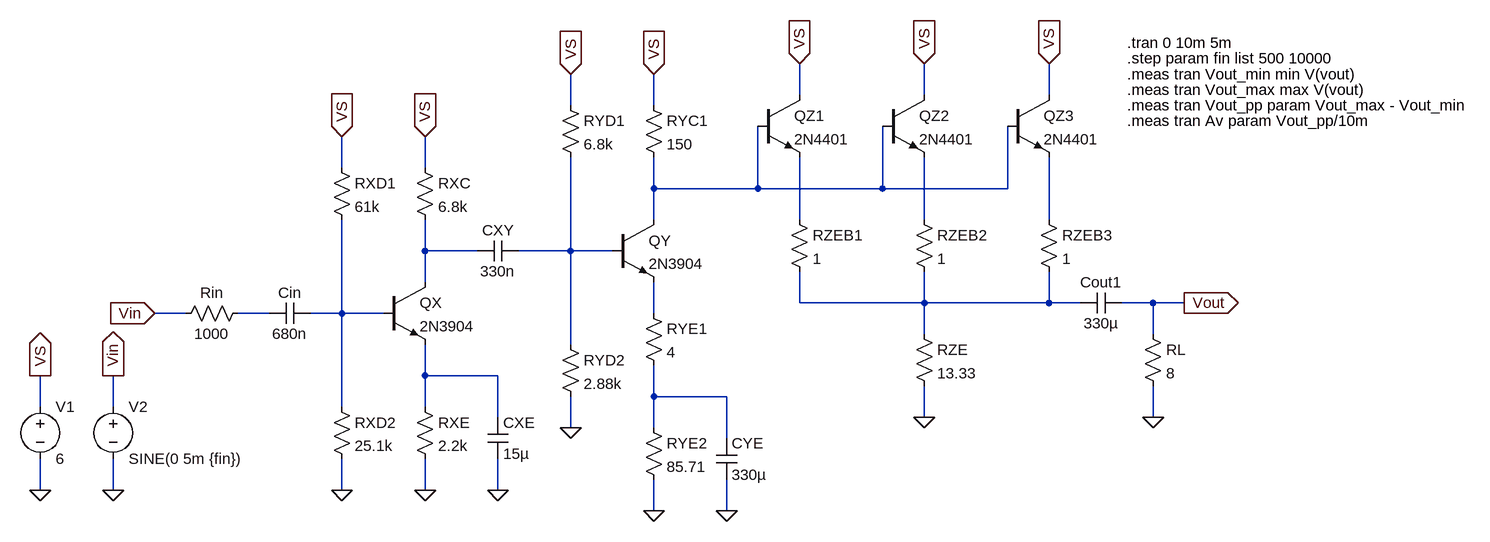
[diagram p0: schematic full.asc]
full.asc, the LTspice schematic file:
Version 4.1
SHEET 1 1884 740
WIRE 800 -224 800 -272
WIRE 992 -224 992 -272
WIRE 1184 -224 1184 -272
WIRE 448 -208 448 -256
WIRE 576 -208 576 -256
WIRE 96 -112 96 -160
WIRE 224 -112 224 -160
WIRE 576 -80 576 -128
WIRE 736 -80 736 -176
WIRE 736 -80 576 -80
WIRE 928 -80 928 -176
WIRE 928 -80 736 -80
WIRE 1120 -80 1120 -176
WIRE 1120 -80 928 -80
WIRE 576 -32 576 -80
WIRE 800 -32 800 -128
WIRE 992 -32 992 -128
WIRE 1184 -32 1184 -128
WIRE 224 16 224 -32
WIRE 304 16 224 16
WIRE 448 16 448 -128
WIRE 448 16 368 16
WIRE 512 16 448 16
WIRE 224 64 224 16
WIRE 800 96 800 48
WIRE 992 96 992 48
WIRE 992 96 800 96
WIRE 1184 96 1184 48
WIRE 1184 96 992 96
WIRE 1232 96 1184 96
WIRE 1344 96 1296 96
WIRE 1392 96 1344 96
WIRE -144 112 -192 112
WIRE -16 112 -64 112
WIRE 96 112 96 -32
WIRE 96 112 48 112
WIRE 160 112 96 112
WIRE 576 112 576 64
WIRE 992 144 992 96
WIRE 1344 144 1344 96
WIRE 448 160 448 16
WIRE 224 208 224 160
WIRE 336 208 224 208
WIRE 576 240 576 192
WIRE 688 240 576 240
WIRE -368 256 -368 208
WIRE -256 256 -256 208
WIRE 96 256 96 112
WIRE 224 256 224 208
WIRE 336 272 336 208
WIRE 992 272 992 224
WIRE 1344 272 1344 224
WIRE 448 288 448 240
WIRE 576 288 576 240
WIRE 688 304 688 240
WIRE -368 384 -368 336
WIRE -256 384 -256 336
WIRE 96 384 96 336
WIRE 224 384 224 336
WIRE 336 384 336 336
WIRE 576 416 576 368
WIRE 688 416 688 368
FLAG 224 384 0
FLAG 336 384 0
FLAG 96 384 0
FLAG -192 112 Vin
IOPIN -192 112 In
FLAG 96 -160 VS
IOPIN 96 -160 In
FLAG 224 -160 VS
IOPIN 224 -160 In
FLAG -256 384 0
FLAG -368 384 0
FLAG -368 208 VS
IOPIN -368 208 Out
FLAG -256 208 Vin
IOPIN -256 208 Out
FLAG 576 416 0
FLAG 688 416 0
FLAG 448 288 0
FLAG 448 -256 VS
IOPIN 448 -256 In
FLAG 576 -256 VS
IOPIN 576 -256 In
FLAG 800 -272 VS
IOPIN 800 -272 In
FLAG 992 -272 VS
IOPIN 992 -272 In
FLAG 1184 -272 VS
IOPIN 1184 -272 In
FLAG 992 272 0
FLAG 1344 272 0
FLAG 1392 96 Vout
IOPIN 1392 96 Out
SYMBOL npn 160 64 R0
SYMATTR InstName QX
SYMATTR Value 2N3904
SYMBOL res 208 240 R0
SYMATTR InstName RXE
SYMATTR Value 2.2k
SYMBOL cap 320 272 R0
SYMATTR InstName CXE
SYMATTR Value 15µ
SYMBOL res 208 -128 R0
SYMATTR InstName RXC
SYMATTR Value 6.8k
SYMBOL res 80 -128 R0
SYMATTR InstName RXD1
SYMATTR Value 61k
SYMBOL res 80 240 R0
SYMATTR InstName RXD2
SYMATTR Value 25.1k
SYMBOL voltage -256 240 R0
WINDOW 123 0 0 Left 0
WINDOW 39 0 0 Left 0
SYMATTR InstName V2
SYMATTR Value SINE(0 5m {fin})
SYMBOL voltage -368 240 R0
SYMATTR InstName V1
SYMATTR Value 6
SYMBOL cap 48 96 R90
WINDOW 0 0 32 VBottom 2
WINDOW 3 32 32 VTop 2
SYMATTR InstName Cin
SYMATTR Value 680n
SYMBOL cap 368 0 R90
WINDOW 0 0 32 VBottom 2
WINDOW 3 32 32 VTop 2
SYMATTR InstName CXY
SYMATTR Value 330n
SYMBOL res -48 96 R90
WINDOW 0 0 56 VBottom 2
WINDOW 3 32 56 VTop 2
SYMATTR InstName Rin
SYMATTR Value 1000
SYMBOL npn 512 -32 R0
SYMATTR InstName QY
SYMATTR Value 2N3904
SYMBOL res 560 272 R0
SYMATTR InstName RYE2
SYMATTR Value 85.71
SYMBOL cap 672 304 R0
SYMATTR InstName CYE
SYMATTR Value 330µ
SYMBOL res 560 -224 R0
SYMATTR InstName RYC1
SYMATTR Value 150
SYMBOL res 432 -224 R0
SYMATTR InstName RYD1
SYMATTR Value 6.8k
SYMBOL res 432 144 R0
SYMATTR InstName RYD2
SYMATTR Value 2.88k
SYMBOL res 560 96 R0
SYMATTR InstName RYE1
SYMATTR Value 4
SYMBOL npn 736 -224 R0
SYMATTR InstName QZ1
SYMATTR Value 2N4401
SYMBOL npn 928 -224 R0
SYMATTR InstName QZ2
SYMATTR Value 2N4401
SYMBOL npn 1120 -224 R0
SYMATTR InstName QZ3
SYMATTR Value 2N4401
SYMBOL res 784 -48 R0
SYMATTR InstName RZEB1
SYMATTR Value 1
SYMBOL res 976 -48 R0
SYMATTR InstName RZEB2
SYMATTR Value 1
SYMBOL res 1168 -48 R0
SYMATTR InstName RZEB3
SYMATTR Value 1
SYMBOL res 976 128 R0
SYMATTR InstName RZE
SYMATTR Value 13.33
SYMBOL cap 1296 80 R90
WINDOW 0 0 32 VBottom 2
WINDOW 3 32 32 VTop 2
SYMATTR InstName Cout1
SYMATTR Value 330µ
SYMBOL res 1328 128 R0
SYMATTR InstName RL
SYMATTR Value 8
TEXT 1304 -304 Left 2 !.tran 0 10m 5m
TEXT 1304 -256 Left 2 !.meas tran Vout_min min V(vout)
TEXT 1304 -232 Left 2 !.meas tran Vout_max max V(vout)
TEXT 1304 -208 Left 2 !.meas tran Vout_pp param Vout_max - Vout_min
TEXT 1304 -184 Left 2 !.meas tran Av param Vout_pp/10m
TEXT 1304 -280 Left 2 !.step param fin list 500 10000

The netlist it stands for:
* full.asc
QX N005 N009 N011 0 2N3904
RXE N011 0 2.2k
CXE N011 0 15µ
RXC VS N005 6.8k
RXD1 VS N009 61k
RXD2 N009 0 25.1k
V2 Vin 0 SINE(0 5m {fin})
V1 VS 0 6
Cin N009 N008 680n
CXY N006 N005 330n
Rin N008 Vin 1000
QY N001 N006 N010 0 2N3904
RYE2 N012 0 85.71
CYE N012 0 330µ
RYC1 VS N001 150
RYD1 VS N006 6.8k
RYD2 N006 0 2.88k
RYE1 N010 N012 4
QZ1 VS N001 N002 0 2N4401
QZ2 VS N001 N003 0 2N4401
QZ3 VS N001 N004 0 2N4401
RZEB1 N002 N007 1
RZEB2 N003 N007 1
RZEB3 N004 N007 1
RZE N007 0 13.33
Cout1 Vout N007 330µ
RL Vout 0 8
.model NPN NPN
.model PNP PNP
.lib standard.bjt
.tran 0 10m 5m
.meas tran Vout_min min V(vout)
.meas tran Vout_max max V(vout)
.meas tran Vout_pp param Vout_max - Vout_min
.meas tran Av param Vout_pp/10m
.step param fin list 500 10000
.backanno
.end